# EAGLE schematic Pi2AVR_wIOFF (EAGLE 7.6.0)
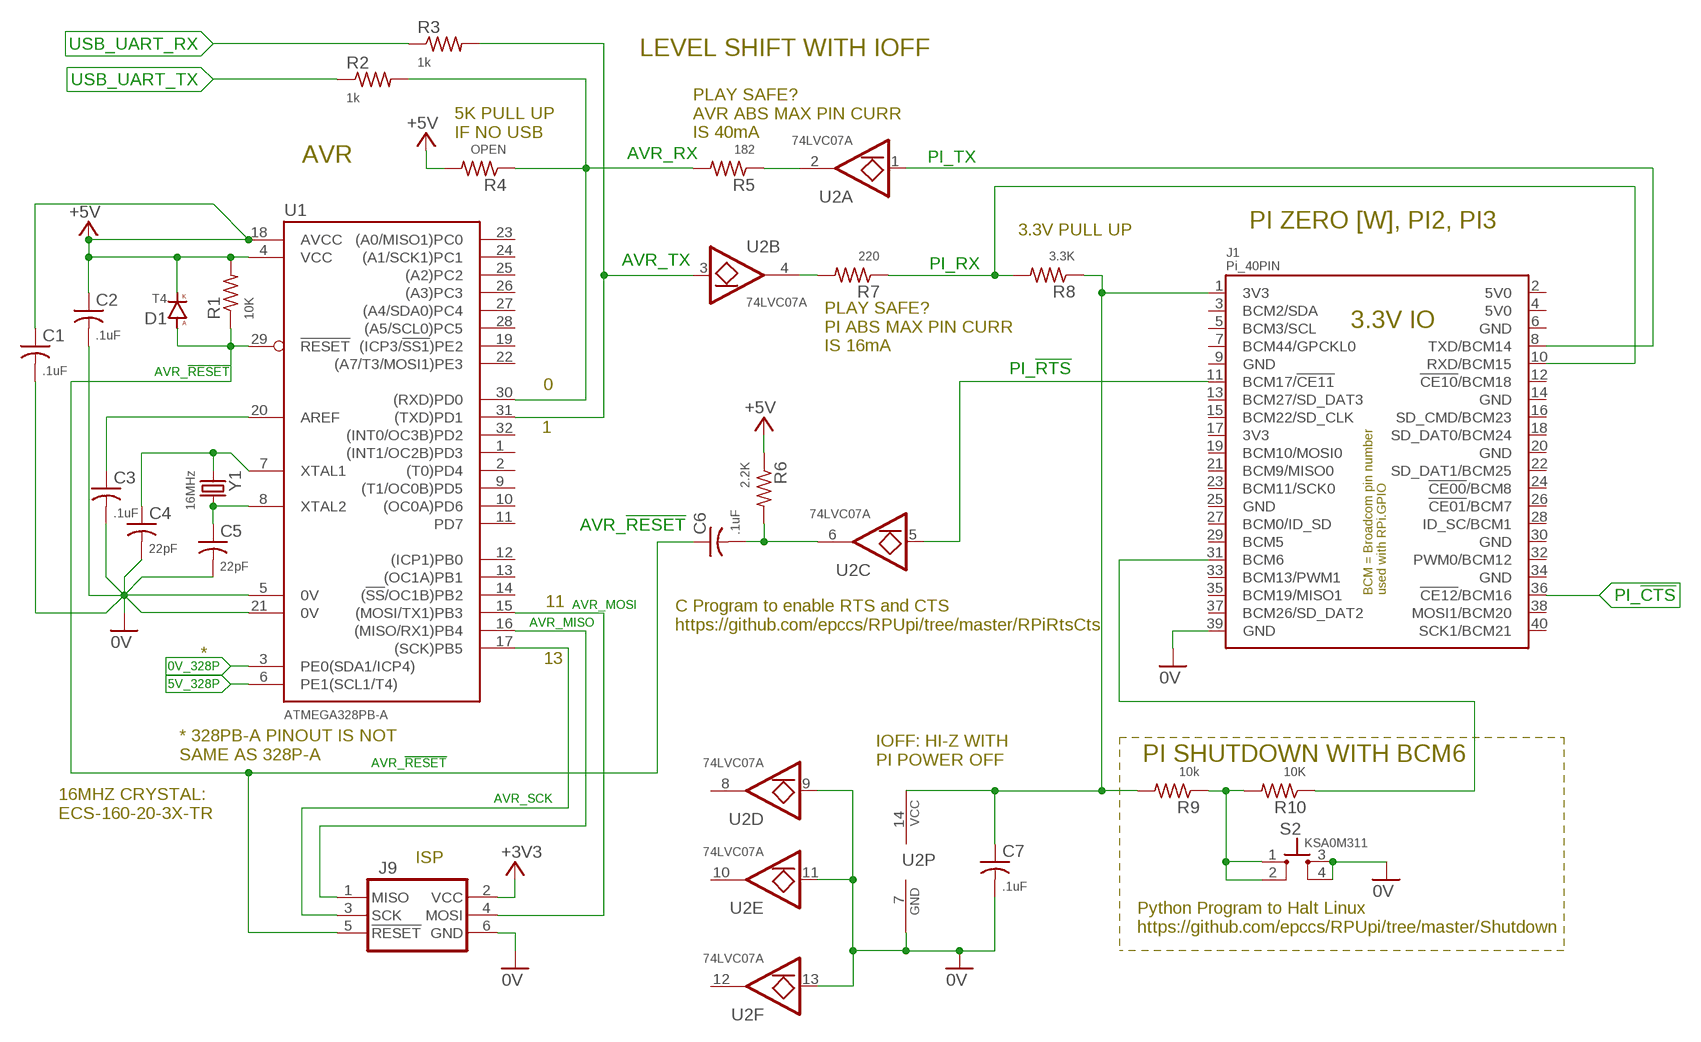
[diagram p0: schematic, sheet 1]

## Parts
C1  .1uF  CC0603A  [C0603(1608)]
C2  .1uF  CC0603A  [C0603(1608)]
C3  .1uF  CC0603A  [C0603(1608)]
C4  22pF  CC0603A  [C0603(1608)]
C5  22pF  CC0603A  [C0603(1608)]
C6  .1uF  CC0603A  [C0603(1608)]
C7  .1uF  CC0603A  [C0603(1608)]
D1  T4  DSOD123  [SOD123]
J1  Pi_40PIN  RPI-ZERO90  [RASPI_ZERO_V40PIN]
J9  ISP-SPIPTH  [ISP]
R1  10K  R0805  [C0805(2012)]
R2  1k  R0805  [C0805(2012)]
R3  1k  R0805  [C0805(2012)]
R4  OPEN  R0805  [C0805(2012)]
R5  182  R0805  [C0805(2012)]
R6  2.2K  R0805  [C0805(2012)]
R7  220  R0805  [C0805(2012)]
R8  3.3K  R0805  [C0805(2012)]
R9  10k  R0805  [C0805(2012)]
R10  10K  R0805  [C0805(2012)]
S2  KSA0M311  [0M311]
U1  ATMEGA328PB-A  ATMEGA328PB-AU  [TQFP32-08]
U2  74LVC07A  7407D  [14SOIC]
Y1  16MHz  CSM-3X  [CSM-3X]

## Nets
0V: C1.2 C2.2 C3.2 C4.2 C5.2 C7.2 J1.39(GND) J9.6(GND) S2.3 S2.4 U1.5(0V) U1.21(0V) U2.7(P:GND) U2.9(D:I) U2.11(E:I) U2.13(F:I)
0V_328P: U1.3(PE0(SDA1/ICP4))
3V3@1: C7.1 J1.1(3V3) R8.1 R9.2 U2.14(P:VCC)
5V_328P: U1.6(PE1(SCL1/T4))
+3V3: J9.2(VCC)
+5V: C1.1 C2.1 D1.C(K) R1.2 R4.2 R6.1 U1.4(VCC) U1.18(AVCC)
AVR_!RESET: C6.1 D1.A J9.5(!RESET) R1.1 U1.29(!RESET)
AVR_MISO: J9.1(MISO) U1.16((MISO/RX1)PB4)
AVR_MOSI: J9.4(MOSI) U1.15((MOSI/TX1)PB3)
AVR_RX: R2.2 R4.1 R5.2 U1.30((RXD)PD0)
AVR_SCK: J9.3(SCK) U1.17((SCK)PB5)
AVR_TX: R3.2 U1.31((TXD)PD1) U2.3(B:I)
MGR_AREF: C3.1 U1.20(AREF)
N$1: J1.31(BCM6) R10.1
N$2: C6.2 R6.2 U2.6(C:O)
N$3: R5.1 U2.2(A:O)
N$4: R7.2 U2.4(B:O)
N$7: R9.1 R10.2 S2.1 S2.2
PI_!CTS!: J1.36(!CE12!/BCM16)
PI_!RTS!: J1.11(BCM17/!CE11!) U2.5(C:I)
PI_RX: J1.10(RXD/BCM15) R7.1 R8.2
PI_TX: J1.8(TXD/BCM14) U2.1(A:I)
USB_UART_RX: R3.1
USB_UART_TX: R2.1
XTAL1: C4.1 U1.7(XTAL1) Y1.1
XTAL2: C5.1 U1.8(XTAL2) Y1.2
Unconnected: J1.2(5V0) J1.3(BCM2/SDA) J1.4(5V0) J1.5(BCM3/SCL) J1.6(GND) J1.7(BCM44/GPCKL0) J1.9(GND) J1.12(!CE10!/BCM18) J1.13(BCM27/SD_DAT3) J1.14(GND) J1.15(BCM22/SD_CLK) J1.16(SD_CMD/BCM23) J1.17(3V3) J1.18(SD_DAT0/BCM24) J1.19(BCM10/MOSI0) J1.20(GND) J1.21(BCM9/MISO0) J1.22(SD_DAT1/BCM25) J1.23(BCM11/SCK0) J1.24(!CE00!/BCM8) J1.25(GND) J1.26(!CE01!/BCM7) J1.27(BCM0/ID_SD) J1.28(ID_SC/BCM1) J1.29(BCM5) J1.30(GND) J1.32(PWM0/BCM12) J1.33(BCM13/PWM1) J1.34(GND) J1.35(BCM19/MISO1) J1.37(BCM26/SD_DAT2) J1.38(MOSI1/BCM20) J1.40(SCK1/BCM21) U1.1((INT1/OC2B)PD3) U1.2((T0)PD4) U1.9((T1/OC0B)PD5) U1.10((OC0A)PD6) U1.11(PD7) U1.12((ICP1)PB0) U1.13((OC1A)PB1) U1.14((!SS!/OC1B)PB2) U1.19((ICP3/!SS1!)PE2) U1.22((A7/T3/MOSI1)PE3) U1.23((A0/MISO1)PC0) U1.24((A1/SCK1)PC1) U1.25((A2)PC2) U1.26((A3)PC3) U1.27((A4/SDA0)PC4) U1.28((A5/SCL0)PC5) U1.32((INT0/OC3B)PD2) U2.8(D:O) U2.10(E:O) U2.12(F:O)

## Notes on the sheet
- LEVEL SHIFT WITH IOFF
- 5K PULL UP
  IF NO USB
- PLAY SAFE?
  AVR ABS MAX PIN CURR
  IS 40mA
- AVR
- PI ZERO [W], PI2, PI3
- 3.3V PULL UP
- PLAY SAFE?
  PI ABS MAX PIN CURR
  IS 16mA
- 0
- 1
- 11
- C Program to enable RTS and CTS
  https://github.com/epccs/RPUpi/tree/master/RPiRtsCts
- *
- 13
- * 328PB-A PINOUT IS NOT 
  SAME AS 328P-A
- PI SHUTDOWN WITH BCM6
- IOFF: HI-Z WITH
  PI POWER OFF
- 16MHZ CRYSTAL:
  ECS-160-20-3X-TR
- ISP
- Python Program to Halt Linux
  https://github.com/epccs/RPUpi/tree/master/Shutdown

## Library data of the parts
C1-C7 = C-C:C: CAPACITOR Symbol
D1 = D-GP:D: DIODE
J1 = U-Pi:RPI-ZERO: Raspberry Pi Zero https://pinout.xyz/ NOTE: WiFi is needed see https://www.kickstarter.com/projects/1991736672/iot-hat-for-raspberry-pi-a-must-have-for-pi-zero
J9 = U-AVR:ISP-SPI: AVR ISP thru SPI In-System Programming uses the target Atmel AVR’s internal SPI (Serial Peripheral Interface) to download code into the flash and EEPROM memories. It is not a debugging interface. When designing an application PCB which includes an AVR with the SPI interface, this pinout should be used. Sparkfun SKU: BOB-08508
R1-R10 = R-C:R: Resiistor American-style symbol
S2 = S-Tactile:KSA: KSA0M311 [C&K,KSA0M311LFT] SWITCH TACTILE SEALED SPST-NO 50MA 32V
U1 = U-AVR:ATMEGA328PB-AU: ATmega328PB 4 Kbytes FLASH 128 bytes SRAM 256 bytes EEPROM 2 UART, 2 I2C, 2 SPI 8-channel 10 bit ADC
U2 = U-7400:74*07: HEX BUFFER, OPEN DRAIN/COLLECTOR 74LVC07A [DIODES,74LVC07AS14-13] LOGIC BUFFER OPEN DRAIN 14SOIC
Y1 = Y-XTL:CSM: 16MHZ20 [ECS,ECS-160-20-3X-TR] CRYSTAL 16MHZ 20PF 30PPM CSM-3X